# Altium schematic sheet ELEC-DEM-555Timer.SchDoc
size A4
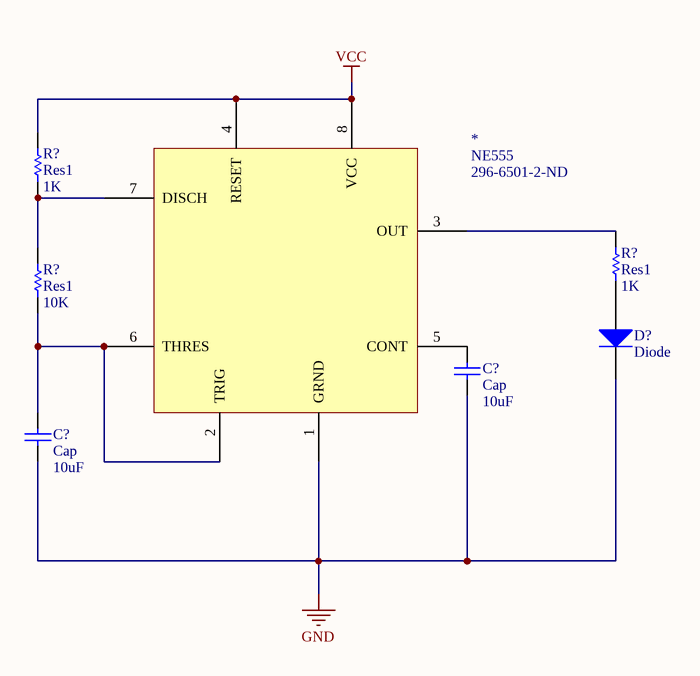
[diagram p0: ELEC-DEM-555Timer.SchDoc]

## Parts
(Parts that share a designator on the sheet are numbered #1, #2 ... from top to bottom, then left to right.)
*  NE555  Supplier Part Number 1: 296-6501-2-ND
C?#1  Cap  value 10uF  [RAD-0.3]
C?#2  Cap  value 10uF  [RAD-0.3]
D?  Diode  [SMC]
R?#1  Res1  value 1K  [AXIAL-0.3]
R?#2  Res1  value 1K  [AXIAL-0.3]
R?#3  Res1  value 10K  [AXIAL-0.3]

## Nets
GND: *.1(GRND) C?#1.1 C?#2.1 D?.2(K)
VCC: *.4(RESET) *.8(VCC) R?#1.2
Net*_2: *.2(TRIG) *.6(THRES) C?#2.2 R?#3.1
Net*_3: *.3(OUT) R?#2.2
Net*_5: *.5(CONT) C?#1.2
Net*_7: *.7(DISCH) R?#1.1 R?#3.2
NetD?_1: D?.1(A) R?#2.1

## Library data of the parts
C?#1 C?#2 = Cap: Capacitor; Published: 8-Jun-2000; LatestRevisionDate: 17-Jul-2002; LatestRevisionNote: Re-released for DXP Platform.; PackageReference: RAD-0.3; Publisher: Altium Limited; PackageDescription: Radial Cap, Thru-Hole; 2 Leads; 0.3 in Pin Spacing
D? = Diode: Default Diode; Published: 8-Jun-2000; LatestRevisionDate: 17-Jul-2002; LatestRevisionNote: Re-released for DXP Platform.; PackageVersion: Sep-1996; PackageReference: SMC; Publisher: Altium Limited; PackageDescription: DO-214-AB/SMC; 2 C-Bend Leads; Body 7.9 x 5.9 mm, inc. leads (LxW); Code_JEDEC: DO-214-AB
R?#1-R?#3 = Res1: Resistor; Published: 8-Jun-2000; LatestRevisionDate: 17-Jul-2002; LatestRevisionNote: Re-released for DXP Platform.; PackageReference: AXIAL-0.3; Publisher: Altium Limited; PackageDescription: Axial Device, Thru-Hole; 2 Leads; 0.3 in Pin Spacing
* = NE555: Supplier 1: Digi-Key